# Altium schematic sheet MC50_Periph.SchDoc
size A3
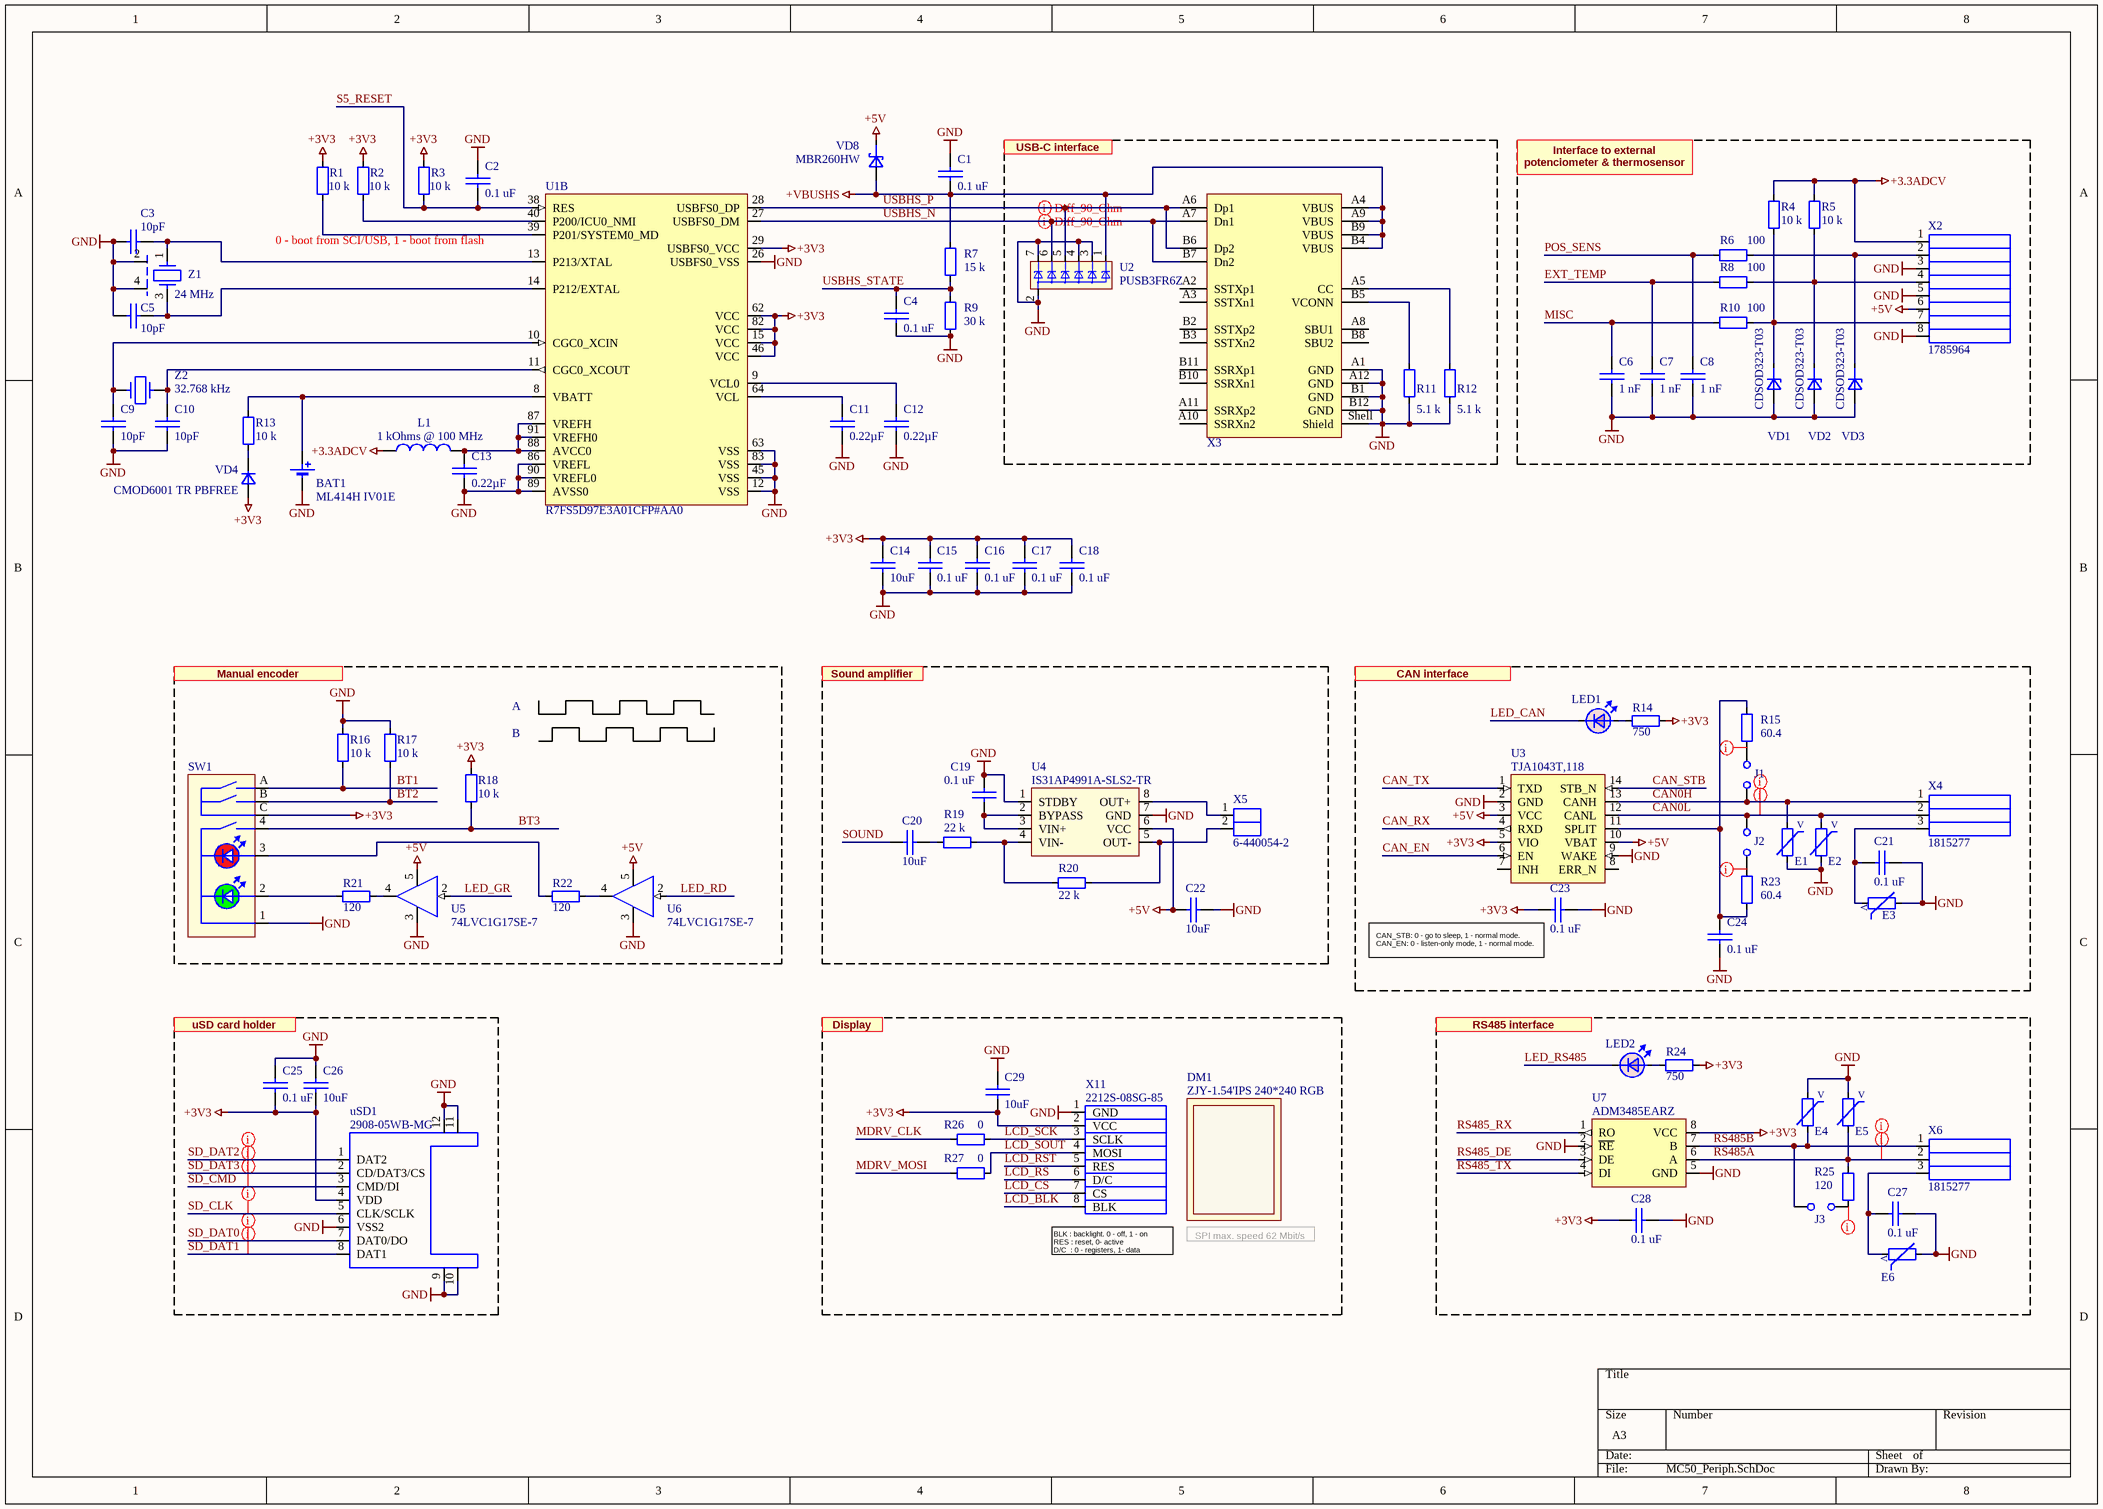
[diagram p0: MC50_Periph.SchDoc]

## Parts
BAT1  ML414H IV01E  [ML414H]
C1  value 0.1 uF  [1608[0603]]  (hidden comment: CL10B104KA8NNND)
C2  value 0.1 uF  [1608[0603]]  (hidden comment: CL10B104KA8NNND)
C3  value 10pF  [0603 CAP]  (hidden comment: Capacitor)
C4  value 0.1 uF  [1608[0603]]  (hidden comment: CL10B104KA8NNND)
C5  value 10pF  [0603 CAP]  (hidden comment: Capacitor)
C6  value 1 nF  [0603 CAP]  (hidden comment: CC0603JRX7R9BB102)
C7  value 1 nF  [0603 CAP]  (hidden comment: CC0603JRX7R9BB102)
C8  value 1 nF  [0603 CAP]  (hidden comment: CC0603JRX7R9BB102)
C9  value 10pF  [0603 CAP]  (hidden comment: Capacitor)
C10  value 10pF  [0603 CAP]  (hidden comment: Capacitor)
C11  value 0.22µF  [0603 CAP]  (hidden comment: Capacitor)
C12  value 0.22µF  [0603 CAP]  (hidden comment: Capacitor)
C13  value 0.22µF  [0603 CAP]  (hidden comment: Capacitor)
C14  value 10uF  [1608[0603]]  (hidden comment: GRM188R61E106KA73D)
C15  value 0.1 uF  [1608[0603]]  (hidden comment: CL10B104KA8NNND)
C16  value 0.1 uF  [1608[0603]]  (hidden comment: CL10B104KA8NNND)
C17  value 0.1 uF  [1608[0603]]  (hidden comment: CL10B104KA8NNND)
C18  value 0.1 uF  [1608[0603]]  (hidden comment: CL10B104KA8NNND)
C19  value 0.1 uF  [1608[0603]]  (hidden comment: CL10B104KA8NNND)
C20  value 10uF  [1608[0603]]  (hidden comment: GRM188R61E106KA73D)
C21  value 0.1 uF  [1608[0603]]  (hidden comment: CL10B104KA8NNND)
C22  value 10uF  [1608[0603]]  (hidden comment: GRM188R61E106KA73D)
C23  value 0.1 uF  [1608[0603]]  (hidden comment: CL10B104KA8NNND)
C24  value 0.1 uF  [1608[0603]]  (hidden comment: CL10B104KA8NNND)
C25  value 0.1 uF  [1608[0603]]  (hidden comment: CL10B104KA8NNND)
C26  value 10uF  [1608[0603]]  (hidden comment: GRM188R61E106KA73D)
C27  value 0.1 uF  [1608[0603]]  (hidden comment: CL10B104KA8NNND)
C28  value 0.1 uF  [1608[0603]]  (hidden comment: CL10B104KA8NNND)
C29  value 10uF  [1608[0603]]  (hidden comment: GRM188R61E106KA73D)
DM1  ZJY-1.54'IPS 240*240 RGB  [1.54 inch IPS 240x240 w/o pins]
E1  ESD03A5V5R17V  [0603]  (value not drawn)
E2  ESD03A5V5R17V  [0603]  (value not drawn)
E3  ESD03A5V5R17V  [0603]  (value not drawn)
E4  ESD03A5V5R17V  [0603]  (value not drawn)
E5  ESD03A5V5R17V  [0603]  (value not drawn)
E6  823 560 505 60  [0603]  (value not drawn)
J1  2PH1-02-UA  [2PH1-02-UA]  (value not drawn)
J2  2PH1-02-UA  [2PH1-02-UA]  (value not drawn)
J3  2PH1-02-UA  [2PH1-02-UA]  (value not drawn)
L1  value 1 kOhms @ 100 MHz  [0603]  (hidden comment: HZ0603B102R-10)
LED1  SML-211UTT86  [0805 LED]  (value not drawn)
LED2  SML-211UTT86  [0805 LED]  (value not drawn)
R1  value 10 k  [0603]  (hidden comment: Resistor)
R2  value 10 k  [0603]  (hidden comment: Resistor)
R3  value 10 k  [0603]  (hidden comment: Resistor)
R4  value 10 k  [0603]  (hidden comment: Resistor)
R5  value 10 k  [0603]  (hidden comment: Resistor)
R6  value 100  [0603]  (hidden comment: Resistor)
R7  value 15 k  [0603]  (hidden comment: Resistor)
R8  value 100  [0603]  (hidden comment: Resistor)
R9  value 30 k  [0603]  (hidden comment: Resistor)
R10  value 100  [0603]  (hidden comment: Resistor)
R11  value 5.1 k  [0603]  (hidden comment: Resistor)
R12  value 5.1 k  [0603]  (hidden comment: Resistor)
R13  value 10 k  [0603]  (hidden comment: Resistor)
R14  value 750  [0603]  (hidden comment: Resistor)
R15  value 60.4  [0603]  (hidden comment: Resistor)
R16  value 10 k  [0603]  (hidden comment: Resistor)
R17  value 10 k  [0603]  (hidden comment: Resistor)
R18  value 10 k  [0603]  (hidden comment: Resistor)
R19  value 22 k  [0603]  (hidden comment: Resistor)
R20  value 22 k  [0603]  (hidden comment: Resistor)
R21  value 120  [0603]  (hidden comment: Resistor)
R22  value 120  [0603]  (hidden comment: Resistor)
R23  value 60.4  [0603]  (hidden comment: Resistor)
R24  value 750  [0603]  (hidden comment: Resistor)
R25  value 120  [0603]  (hidden comment: Resistor)
R26  value 0  [0603]  (hidden comment: Resistor)
R27  value 0  [0603]  (hidden comment: Resistor)
SW1  PEL12D-4225S-S2024  [PEL12D-4225S-S2024]  (value not drawn)
U1  R7FS5D97E3A01CFP#AA0  [P-LFQFP100-14x14-0.50]  (part B of 2)
U2  PUSB3FR6Z  [SOT1358-1]
U3  TJA1043T,118  [SOT108-1]
U4  IS31AP4991A-SLS2-TR  [MSOP-8]
U5  74LVC1G17SE-7  [SOT-353 ON Semi]
U6  74LVC1G17SE-7  [SOT-353 ON Semi]
U7  ADM3485EARZ  [SO-8]
uSD1  2908-05WB-MG  [2908-05WB-MG]
VD1  CDSOD323-T03  [SOD323]
VD2  CDSOD323-T03  [SOD323]
VD3  CDSOD323-T03  [SOD323]
VD4  CMOD6001 TR PBFREE  [SOD523]
VD8  MBR260HW  [SOD-123]
X2  1785964  [1785964]
X3  632722110112  [632722110112]  (value not drawn)
X4  1815277  [1815277]
X5  6-440054-2  [6-440054-2]
X6  1815277  [1815277]
X11  2212S-08SG-85  [2212S-08SG-85]
Z1  value 24 MHz  [4-SMD 2.00mm x 1.60mm]  (hidden comment: ABM11-24.000MHZ-D2X-T3)
Z2  value 32.768 kHz  [ABS7]  (hidden comment: ABS07-32.768KHZ-T)

## Nets
+3.3ADCV: L1.1 R4.2 R5.2 X2.1
+3V3: C14.1 C15.2 C16.2 C17.2 C18.2 C23.2 C25.1 C26.2 C28.2 C29.2 R1.2 R2.2 R3.2 R14.2 R18.2 R24.2 SW1.C U1.15(VCC) U1.29(USBFS0_VCC) U1.46(VCC) U1.62(VCC) U1.82(VCC) U3.5(VIO) U7.8(VCC) uSD1.4(VDD) VD4.2(A) X11.2(VCC)
+5V: C22.1 U3.3(VCC) U3.10(VBAT) U4.6(VCC) U5.5(VCC) U6.5(VCC) VD8.1(C) X2.6
+VBUSHS: C1.1 R7.2 U2.1 VD8.2(A) X3.A4(VBUS) X3.A9(VBUS) X3.B4(VBUS) X3.B9(VBUS)
GND: BAT1.1 C1.2 C2.2 C3.1 C4.1 C5.1 C6.2 C7.2 C8.2 C9.1 C10.1 C11.2 C12.2 C13.2 C14.2 C15.1 C16.1 C17.1 C18.1 C19.2 C21.2 C22.2 C23.1 C24.1 C25.2 C26.1 C27.2 C28.1 C29.1 E1.1 E2.1 E3.1 E4.2 E5.2 E6.1 R9.1 R11.1 R12.1 R16.2 R17.2 SW1.1 U1.12(VSS) U1.26(USBFS0_VSS) U1.45(VSS) U1.63(VSS) U1.83(VSS) U1.86(VREFL) U1.89(AVSS0) U1.90(VREFL0) U2.2 U2.3 U2.4 U2.7 U3.2(GND) U3.9(WAKE) U4.1(STDBY) U4.7(GND) U5.3(GND) U6.3(GND) U7.2(~{RE}) U7.5(GND) uSD1.6(VSS2) uSD1.9 uSD1.10(WP) uSD1.11(GND) uSD1.12(GND) VD1.2 VD2.2 VD3.2 X2.3 X2.5 X2.8 X3.A1(GND) X3.A12(GND) X3.B1(GND) X3.B12(GND) X3.Shell(Shield) X11.1(GND) Z1.2 Z1.4
BT1: R16.1 SW1.A
BT2: R17.1 SW1.B
BT3: R18.1 SW1.4
CAN0H: E1.2 J1.1 U3.13(CANH) X4.1
CAN0L: E2.2 J2.2 U3.12(CANL) X4.2
CAN_EN: U3.6(EN)
CAN_RX: U3.4(RXD)
CAN_STB: U3.14(STB_N)
CAN_TX: U3.1(TXD)
EXT_TEMP: C7.1 R8.2
LCD_BLK: X11.8(BLK)
LCD_CS: X11.7(CS)
LCD_RS: X11.6(D/C)
LCD_RST: X11.5(RES)
LCD_SCK: R26.2 X11.3(SCLK)
LCD_SOUT: R27.1 X11.4(MOSI)
LED_CAN: LED1.2
LED_GR: U5.2(A)
LED_RD: U6.2(A)
LED_RS485: LED2.2
MDRV_CLK: R26.1
MDRV_MOSI: R27.2
MISC: C6.1 R10.2
POS_SENS: C8.1 R6.2
RS485_DE: U7.3(DE)
RS485_RX: U7.1(RO)
RS485_TX: U7.4(DI)
RS485A: E5.1 R25.2 U7.6(A) X6.2
RS485B: E4.1 J3.1 U7.7(B) X6.1
S5_RESET: C2.1 R3.1 U1.38(RES)
SD_CLK: uSD1.5(CLK/SCLK)
SD_CMD: uSD1.3(CMD/DI)
SD_DAT0: uSD1.7(DAT0/DO)
SD_DAT1: uSD1.8(DAT1)
SD_DAT2: uSD1.1(DAT2)
SD_DAT3: uSD1.2(CD/DAT3/CS)
SOUND: C20.1
USBHS_N: U1.27(USBFS0_DM) U2.6 X3.A7(Dn1) X3.B7(Dn2)
USBHS_P: U1.28(USBFS0_DP) U2.5 X3.A6(Dp1) X3.B6(Dp2)
USBHS_STATE: C4.2 R7.1 R9.2
NetBAT1_2: BAT1.2 R13.2 U1.8(VBATT)
NetC3_2: C3.2 U1.13(P213/XTAL) Z1.1
NetC5_2: C5.2 U1.14(P212/EXTAL) Z1.3
NetC9_2: C9.2 U1.10(CGC0_XCIN) Z2.1
NetC10_2: C10.2 U1.11(CGC0_XCOUT) Z2.2
NetC11_1: C11.1 U1.64(VCL)
NetC12_1: C12.1 U1.9(VCL0)
NetC13_1: C13.1 L1.2 U1.87(VREFH) U1.88(AVCC0) U1.91(VREFH0)
NetC19_1: C19.1 U4.2(BYPASS) U4.3(VIN+)
NetC20_2: C20.2 R19.1
NetC21_1: C21.1 E3.2 X4.3
NetC24_2: C24.2 R15.2 R23.1 U3.11(SPLIT)
NetC27_1: C27.1 E6.2 X6.3
NetJ1_2: J1.2 R15.1
NetJ2_1: J2.1 R23.2
NetJ3_2: J3.2 R25.1
NetLED1_1: LED1.1 R14.1
NetLED2_1: LED2.1 R24.1
NetR1_1: R1.1 U1.39(P201/SYSTEM0_MD)
NetR2_1: R2.1 U1.40(P200/ICU0_NMI)
NetR4_1: R4.1 R10.1 VD1.1 X2.7
NetR5_1: R5.1 R8.1 VD2.1 X2.4
NetR6_1: R6.1 VD3.1 X2.2
NetR11_2: R11.2 X3.B5(VCONN)
NetR12_2: R12.2 X3.A5(CC)
NetR13_1: R13.1 VD4.1(C)
NetR19_2: R19.2 R20.1 U4.4(VIN-)
NetR20_2: R20.2 U4.5(OUT-) X5.2
NetR21_1: R21.1 U5.4(Y)
NetR21_2: R21.2 SW1.2
NetR22_1: R22.1 U6.4(Y)
NetR22_2: R22.2 SW1.3
NetU4_8: U4.8(OUT+) X5.1

Not connected (* = marked no-connect by the designer): U3 7(INH) 8(ERR_N); X3 A2(SSTXp1) A3(SSTXn1) A8(SBU1) A10(SSRXn2) A11(SSRXp2) B2(SSTXp2) B3(SSTXn2) B8(SBU2) B10(SSRXn1) B11(SSRXp1)

## Layout directives
differential pair; rule Differential Pairs Routing [Pref Gap = 0.127mm    Min Gap  = 0.127mm    Max Gap  = 0.127mmPref Width = 0.143mm    Min Width  = 0.084mm    Max Width  = 0.143mm]: USBHS_N, USBHS_P
net class CAN: CAN0H, CAN0L, NetJ1_2, NetJ2_1
net class uSD: SD_CLK, SD_CMD, SD_DAT0, SD_DAT1, SD_DAT2, SD_DAT3
net class RS485: NetJ3_2, RS485A, RS485B

## Notes on the sheet
- USB-C interface
- Interface to external potenciometer & thermosensor
- (near U1) 0 - boot from SCI/USB, 1 - boot from flash
- Manual encoder
- A
- Sound amplifier
- CAN interface
- (near R18) B
- (near C23) CAN_STB: 0 - go to sleep, 1 - normal mode.
  CAN_EN: 0 - listen-only mode, 1 - normal mode.
- uSD card holder
- Display
- (near LED2) RS485 interface
- (near X11) BLK : backlight. 0 - off, 1 - on
  RES : reset, 0- active
  D/C  : 0 - registers, 1- data
- SPI max. speed 62 Mbit/s
- (in symbol ESD03A5V5R17V) V

## Library data of the parts
BAT1 = ML414H IV01E: Coin, 4.8mm 3V Lithium Battery Rechargeable (Secondary) 1mAh; PartNum: 728-1052-1-ND; Manufacturer: Seiko Instruments; Distributor: Digi-Key; PartName: ML414H IV01E
C1 C2 C4 C15-C19 C21 C23-C25 C27 C28 = 0603B104K500CT: 0.1 µF ±10% 50V Ceramic Capacitor X7R 0603 (1608 Metric), / -55°C ~ 125°C; Manufacturer: Walsin Technology Corporation; PartNum: 1292-1643-1-ND; Tolerance: +-10%; Distributor: Digi-Key; PartName: 0603B104K500CT; Voltage: 50V; Price: 0.0062 Euro
C3 C5 C9 C10 = CL10C100JB8NCNC: 10pF, ±5%, 50V, C0G, NP0, 0603 (1608 Metric), -55°C ~ 125°C, -, General Purpose; Manufacturer: Samsung Electro-Mechanics; PartNum: 1276-2154-1-ND; Part Number: CL10C100JB8NCNC; Distributor: Digi-Key; PartName: CL10C100JB8NCNC; Price: 0.01330; Tolerance: ±5%; Voltage - Rated: 50V; Temperature Coefficient: C0G, NP0; Operating Temperature: -55°C ~ 125°C; Features: -; Package / Case: 0603 (1608 Metric)
C6-C8 = CC0603JRX7R9BB102: 1000pF, ±5%, 50V, X7R, 0603 (1608 Metric), -55°C ~ 125°C, -, General Purpose; Manufacturer: Yageo; PartNum: 311-3361-1-ND; Voltage - Rated: 50V; Part Number: CC0603JRX7R9BB102; Distributor: Digi-Key; PartName: CC0603JRX7R9BB102; Price: 0.01920; Tolerance: ±5%; Temperature Coefficient: X7R; Operating Temperature: -55°C ~ 125°C; Features: -; Package / Case: 0603 (1608 Metric)
C11-C13 = GRM188R71H224KAC4D: 0.22µF, ±10%, 50V, X7R, 0603 (1608 Metric), -55°C ~ 125°C, -, General Purpose; Manufacturer: Murata Electronics North America; PartNum: 490-12546-1-ND; Part Number: GRM188R71H224KAC4D; Distributor: Digi-Key; PartName: GRM188R71H224KAC4D; Price: 0.08140; Tolerance: ±10%; Voltage - Rated: 50V; Temperature Coefficient: X7R; Operating Temperature: -55°C ~ 125°C; Features: -; Package / Case: 0603 (1608 Metric)
C14 C20 C22 C26 C29 = GRM188R61E106KA73D: 10 µF ±10% 25V Ceramic Capacitor X5R 0603 (1608 Metric), -55°C ~ 85°C; Manufacturer: Murata Electronics; PartNum: 490-18214-1-ND; Tolerance: ±10%; Price: 0.41$; Distributor: Digi-Key; Voltage: 25V; PartName: GRM188R61E106KA73D
DM1 = ZJY-1.54'IPS 240*240 RGB: 1.54-inch color screen,support 65K color display, 4-line SPI interface, 240x240 resolution, 32.00x43.72 mm; PartNum: ZJY-1.54'IPS 240*240(RGB); Distributor: Lemona; Price: 4.25; PartName: ZJY-1.54'IPS 240*240(RGB); ComponentLink1Description: New link; ComponentLink1URL: https://www.aliexpress.com/item/1005003760323160.html?spm=a2g0o.detail.1000014.14.5e183756UknwOR&gps-id=pcDetailBottomMoreOtherSeller&scm=1007.40050.281175.0&scm_id=1007.40050.281175.0&scm-url=1007.40050.281175.0&pvid=87ced9b3-44cc-48c7-b549-783d7ed741bb&_t=gps-id:pcDetailBottomMoreOtherSeller,scm-url:1007.40050.281175.0,pvid:87ced9b3-44cc-48c7-b549-783d7ed741bb,tpp_buckets:668%232846%238108%231977&isseo=y&pdp_ext_f=%7B%22sku_id%22%3A%2212000027073447131%22%2C%22sceneId%22%3A%2230050%22%7D&pdp_npi=2%40dis%21EUR%214.45%213.33%21%21%21%21%21%402101f6b916710293274012289ebf1f%2112000027073447131%21rec
E1-E6 = ESD03A5V5R17V: Low and Ultra Low Capacitance ESD Suppressor, Voperating=5.5V, Vclamp=17V, < 1nS,1nA, 0603,; Manufacturer: Stackpole Electronics Inc; PartNum: ESD03A5V5R17VCT-ND; Voltage: 17V; Distributor: Digi-Key; PartName: ESD03A5V5R17V; Price: 0.1$
J1-J3 = 2PH1-02-UA: Connector Header Through Hole 2 position 0.079" (2.00mm); Manufacturer: Adam Tech; PartNum: 2057-2PH1-02-UA-ND; Distributor: Digi-Key; PartName: 2PH1-02-UA; Price: 0.04
L1 = HZ0603B102R-10: 1 kOhms @ 100 MHz 1 Power, Signal Line Ferrite Bead 0603 (1608 Metric) 200mA 600mOhm; Manufacturer: Laird-Signal Integrity Products; PartNum: 240-2378-1-ND; Distributor: Digi-Key; Price: 0.06$; PartName: HZ0603B102R-10
LED1 LED2 = SML-211UTT86: 0805 red LED, hibright, 2 mA, 1.8V, 130°; Manufacturer: Rohm; PartNum: 511-1292-1-ND; Distributor: Digi-Key; Price: 0.34$; Value: Red; PartName: SML-211UTT86
R1-R5 R13 R16-R18 = CR0603-FX-1002GLF: 10 kOhms, ±1%, 0.1W, 1/10W, Thick Film, ±100ppm/°C, 0603 (1608 Metric), -55°C ~ 155°C, Moisture Resistant; Manufacturer: Bourns Inc.; PartNum: CR0603-FX-1002GLFCT-ND; Voltage: 75V; Distributor: Digi-Key; Price: 0.00860; Tolerance: ±1%; PartName: CR0603-FX-1002GLF; Part Number: CR0603-FX-1002GLF; Temperature Coefficient: ±100ppm/°C; Operating Temperature: -55°C ~ 155°C; Power (Watts): 0.1W, 1/10W; Features: Moisture Resistant; Package / Case: 0603 (1608 Metric)
R6 R8 R10 = RMCF0603FT100R: 100 Ohms, ±1%, 0.1W, 1/10W, Thick Film, ±100ppm/°C, 0603 (1608 Metric), -55°C ~ 155°C, Automotive AEC-Q200; Manufacturer: Stackpole Electronics Inc.; PartNum: RMCF0603FT100RCT-ND; Voltage: 75V; Distributor: Digi-Key; Price: 0.00690; Tolerance: ±1%; PartName: RMCF0603FT100R; Part Number: RMCF0603FT100R; Temperature Coefficient: ±100ppm/°C; Operating Temperature: -55°C ~ 155°C; Power (Watts): 0.1W, 1/10W; Features: Automotive AEC-Q200; Package / Case: 0603 (1608 Metric)
R7 = RMCF0603FG15K0: 15 kOhms, ±1%, 0.1W, 1/10W, Thick Film, ±100ppm/°C, 0603 (1608 Metric), -55°C ~ 155°C, Automotive AEC-Q200; Manufacturer: Stackpole Electronics Inc.; PartNum: RMCF0603FG15K0CT-ND; Voltage: 75V; Distributor: Digi-Key; Price: 0.00690; Tolerance: ±1%; PartName: RMCF0603FG15K0; Part Number: RMCF0603FG15K0; Temperature Coefficient: ±100ppm/°C; Operating Temperature: -55°C ~ 155°C; Power (Watts): 0.1W, 1/10W; Features: Automotive AEC-Q200; Package / Case: 0603 (1608 Metric)
R9 = RMCF0603FT30K0: 30 kOhms, ±1%, 0.1W, 1/10W, Thick Film, ±100ppm/°C, 0603 (1608 Metric), -55°C ~ 155°C, Automotive AEC-Q200; Manufacturer: Stackpole Electronics Inc.; PartNum: RMCF0603FT30K0CT-ND; Voltage: 75V; Distributor: Digi-Key; Price: 0.00690; Tolerance: ±1%; PartName: RMCF0603FT30K0; Part Number: RMCF0603FT30K0; Temperature Coefficient: ±100ppm/°C; Operating Temperature: -55°C ~ 155°C; Power (Watts): 0.1W, 1/10W; Features: Automotive AEC-Q200; Package / Case: 0603 (1608 Metric)
R11 R12 = RMCF0603FT5K10: 5.1 kOhms, ±1%, 0.1W, 1/10W, Thick Film, ±100ppm/°C, 0603 (1608 Metric), -55°C ~ 155°C, Automotive AEC-Q200; Manufacturer: Stackpole Electronics Inc.; PartNum: RMCF0603FT5K10CT-ND; Voltage: 75V; Distributor: Digi-Key; Price: 0.00690; Tolerance: ±1%; PartName: RMCF0603FT5K10; Part Number: RMCF0603FT5K10; Temperature Coefficient: ±100ppm/°C; Operating Temperature: -55°C ~ 155°C; Power (Watts): 0.1W, 1/10W; Features: Automotive AEC-Q200; Package / Case: 0603 (1608 Metric)
R14 R24 = RMCF0603FT750R: 750 Ohms, ±1%, 0.1W, 1/10W, Thick Film, ±100ppm/°C, 0603 (1608 Metric), -55°C ~ 155°C, Automotive AEC-Q200; Manufacturer: Stackpole Electronics Inc.; PartNum: RMCF0603FT750RCT-ND; Voltage: 75V; Distributor: Digi-Key; Price: 0.00690; Tolerance: ±1%; PartName: RMCF0603FT750R; Temperature Coefficient: ±100ppm/°C; Operating Temperature: -55°C ~ 155°C; Power (Watts): 0.1W, 1/10W; Features: Automotive AEC-Q200; Package / Case: 0603 (1608 Metric)
R15 R23 = CRCW060360R4FKEA: 60.4 Ohms, ±1%, 0.1W, 1/10W, Thick Film, ±100ppm/°C, 0603 (1608 Metric), -55°C ~ 155°C, Automotive AEC-Q200; Manufacturer: Vishay Dale; PartNum: 541-60.4HCT-ND; Voltage: 75V; Distributor: Digi-Key; Price: 0.01700; Tolerance: ±1%; PartName: CRCW060360R4FKEA; Part Number: CRCW060360R4FKEA; Temperature Coefficient: ±100ppm/°C; Operating Temperature: -55°C ~ 155°C; Power (Watts): 0.1W, 1/10W; Features: Automotive AEC-Q200; Package / Case: 0603 (1608 Metric)
R19 R20 = RMCF0603FG22K0: 22 kOhms, ±1%, 0.1W, 1/10W, Thick Film, ±100ppm/°C, 0603 (1608 Metric), -55°C ~ 155°C, Automotive AEC-Q200; Manufacturer: Stackpole Electronics Inc.; PartNum: RMCF0603FG22K0CT-ND; Voltage: 75V; Distributor: Digi-Key; Price: 0.00690; Tolerance: ±1%; PartName: RMCF0603FG22K0; Part Number: RMCF0603FG22K0; Temperature Coefficient: ±100ppm/°C; Operating Temperature: -55°C ~ 155°C; Power (Watts): 0.1W, 1/10W; Features: Automotive AEC-Q200; Package / Case: 0603 (1608 Metric)
R21 R22 R25 = RMCF0603FT120R: 120 Ohms, ±1%, 0.1W, 1/10W, Thick Film, ±100ppm/°C, 0603 (1608 Metric), -55°C ~ 155°C, Automotive AEC-Q200; Manufacturer: Stackpole Electronics Inc.; PartNum: RMCF0603FT120RCT-ND; Voltage: 75V; Distributor: Digi-Key; Price: 0.00690; Tolerance: ±1%; PartName: RMCF0603FT120R; Temperature Coefficient: ±100ppm/°C; Operating Temperature: -55°C ~ 155°C; Power (Watts): 0.1W, 1/10W; Features: Automotive AEC-Q200; Package / Case: 0603 (1608 Metric)
  R21 R22: Part Number: RMCF0603FT120R
R26 R27 = RMCF0603ZT0R00: 0 Ohms, 0.1W, 1/10W, Thick Film, 0603 (1608 Metric), -55°C ~ 155°C, Automotive AEC-Q200; Manufacturer: Stackpole Electronics Inc.; PartNum: RMCF0603ZT0R00CT-ND; Distributor: Digi-Key; Price: 0.00690; Tolerance: -; Voltage: -; PartName: RMCF0603ZT0R00; Part Number: RMCF0603ZT0R00; Temperature Coefficient: -; Operating Temperature: -55°C ~ 155°C; Power (Watts): 0.1W, 1/10W; Features: Automotive AEC-Q200; Package / Case: 0603 (1608 Metric)
SW1 = PEL12D-4225S-S2024: Rotary Encoder Mechanical 24 Quadrature (Incremental) Vertical; Manufacturer: Bourns Inc.; PartNum: PEL12D-4225S-S2024-ND; Distributor: Digi-Key; PartName: PEL12D-4225S-S2024; Price: 3.62$
U1 = R7FS5D97E3A01CFP#AA0: Manufacturer: Renesas; PartNum: 968-S5D97E3A01CFPAA0; Distributor: Mouser; PartName: R7FS5D97E3A01CFP#AA0; Price: 18.78$
U2 = PUSB3FR6Z: TVS Diode, 3V (Typ) Clamp 5A (8/20µs) Ipp ,  7-XSON (1.1x2.1), -40°C ~ 85°C (TA); Manufacturer: Nexperia USA Inc.; PartNum: 1727-2027-1-ND; Voltage: 3.3 V; Distributor: Digi-Key; Price: 0.41$; PartName: PUSB3FR6Z; Supplier 1: Arrow Electronics; Supplier Part Number 1: PUSB3FR6Z
U3 = TJA1043T,118: 1/1 Transceiver Half CANbus, 5Mbps, 4.5-5.5V, 3V IO,  14-SO, -40°C ~ 150°C; Manufacturer: NXP; PartNum: 2776120RL; Price: 1.41; Distributor: Farnell; PartName: TJA1043T,118
U4 = IS31AP4991A-SLS2-TR: Amplifier IC 1-Channel (Mono) Class AB, 2.7V ~ 5.5V,  1.15W x 1 @ 8Ohm, 8-MSOP, -40°C ~ 85°C (TA); Manufacturer: Lumissil Microsystems; PartNum: 2521-IS31AP4991A-SLS2-TRCT-ND; Price: 0.37; Distributor: Digi-Key; PartName: IS31AP4991A-SLS2-TR
U5 U6 = 74LVC1G17SE-7: IC SGL SCHMITT BUFFER SOT353; Manufacturer: Diodes Incorporated; PartNum: 74LVC1G17SE-7CT-ND; Distributor: Digi-Key; PartName: 74LVC1G17SE-7
U7 = ADM3485EARZ: 1/1 Transceiver Half RS422, RS485, VCC 3.3 V,  8-SOIC, -40°C ~ 85°C; Manufacturer: Analog Devices; PartNum: 584-ADM3485EARZ-R7; Price: 2.35$; Distributor: Mouser; PartName: ADM3485EARZ
uSD1 = 2908-05WB-MG: microSD cadr holder; Manufacturer: 3M; Price: 2.71$; Distributor: Farnell; PartNum: 2908-05WB-MG; PartName: 2908-05WB-MG; Supplier 1: RSComponents; Supplier Part Number 1: 212799
VD1-VD3 = CDSOD323-T03: TVS 350W, 3.3V, Vbrk=4V, -55..150C, SC-76, SOD-323; Manufacturer: Bourns Inc.; PartNum: CDSOD323-T03CT-ND; Distributor: Digi-Key; Price: 0.6$; Voltage: 3.3V; PartName: CDSOD323-T03
VD4 = BAV116T-7: Diode Standard 85V 100mA, 005nA @ 75V, SOD-523, -65°C ~ 150°C; Manufacturer: Central Semiconductor Corp; PartNum: 1514-CMOD6001TRPBFREECT-ND; Distributor: Digi-Key; Price: 0.24$; PartName: CMOD6001 TR PBFREE
VD8 = APD240KDTR-G1: Diode Schottky  60V, 2A, 660mV @ 2A, -, SOD-123, -55°C ~ 150°C; Manufacturer: Diodes Incorporated; PartNum: 1655-MBR260HWCT-ND; Voltage - DC Reverse (Vr) (Max): 40V; Voltage - Forward (Vf) (Max) @ If: 500mV @ 2A; Speed: Fast Recovery =< 500ns, > 200mA (Io); Current - Reverse Leakage @ Vr: 500µA @ 40V; PartName: MBR260HW; Part Number: APD240KDTR-G1; Distributor: Digi-Key; Price: 0.19370; Current - Average Rectified (Io): 2A; Reverse Recovery Time (trr): -; Operating Temperature: -65°C ~ 125°C; Package / Case: SOD-123
X2 = 1785964: PCB headers, nominal current: 6 A, rated voltage (III/2): 160 V, number of positions: 8, pitch: 2.5 mm, color: black, contact surface: Tin, mounting: THR soldering; Manufacturer: Phoenix Contact; Distributor: Phoenix Contact; PartNum: 1785964; PartName: 1785964
X3 = 632722110112: WR-USB 3.1 Type C, Receptacle, Vertical, SMT; Manufacturer: Wurth Elektronik; Interface Type: Type C; Number of Ports: 1; Rated Current: 5A; Working Voltage: 20VAC; ComponentLink1Description: Website Link; ComponentLink1URL: https://www.we-online.com/redexpert/article/632722110112?ad; ComponentLink2Description: Datasheet Link; ComponentLink2URL: https://www.we-online.com/redexpert/spec/632722110112?ad; Manufacturer Part Number: 632722110112; Category: Input/Output Connectors; Match Code: WR-USB; Mount: Surface Mount; Operating Temperature Max: 85°C; Operating Temperature Min: -40°C; Packaging: Tape and Reel; Application: USB 3.1; Gender: Receptacle; Number of Pins: 24; Orientation: Vertical
X4 X6 = 1815277: PCB headers, nominal current: 6 A, rated voltage (III/2): 160 V, number of positions: 3, pitch: 2.5 mm, color: white, contact surface: Tin, mounting: THR soldering; Manufacturer: Phoenix Contact; Distributor: Phoenix Contact; PartNum: 1815277; PartName: 1815277
X5 = 6-440054-2: Connector Header Through Hole, Right Angle 2 position 0.079" (2.00mm); Manufacturer: TE Connectivity AMP Connectors; PartNum: A128968-ND; Distributor: Digi-Key; Price: 0.03; PartName: 6-440054-2
X11 = 2212S-08SG-85: PCB Receptacle, Board-to-Board, 2.54 mm, 1 Rows, 8 Contacts, Through Hole Mount, 2212S; Manufacturer: MULTICOMP PRO; PartNum: 1593463; Distributor: Farnell; PartName: 2212S-08SG-85; Price: 0.14
Z1 = ABM11-24.000MHZ-D2X-T3: 24 MHz, 10 pF, ±20ppm, 2.00mm x 1.60mm, -40°C ~ 85°C; Manufacturer: Abracon LLC; PartNum: 535-10940-1-ND; Price: 1.36 $; Distributor: Digi-Key; Tolerance: 20 ppm; PartName: ABM11-24.000MHZ-D2X-T3
Z2 = ABS07-32.768KHZ-T: 32.768 kHz, 12.5 pF, 70 kOhm, ±20ppm, 3.2 x 1.5 mm, -40°C ~ 85°C; Manufacturer: Abracon Corporation; PartNum: 535-9542-1-ND; Price: 1.09$; Distributor: Digi-Key; Tolerance: 20 ppm; PartName: ABS07-32.768KHZ-T